# Altium project Gate_Driver.PrjPcb
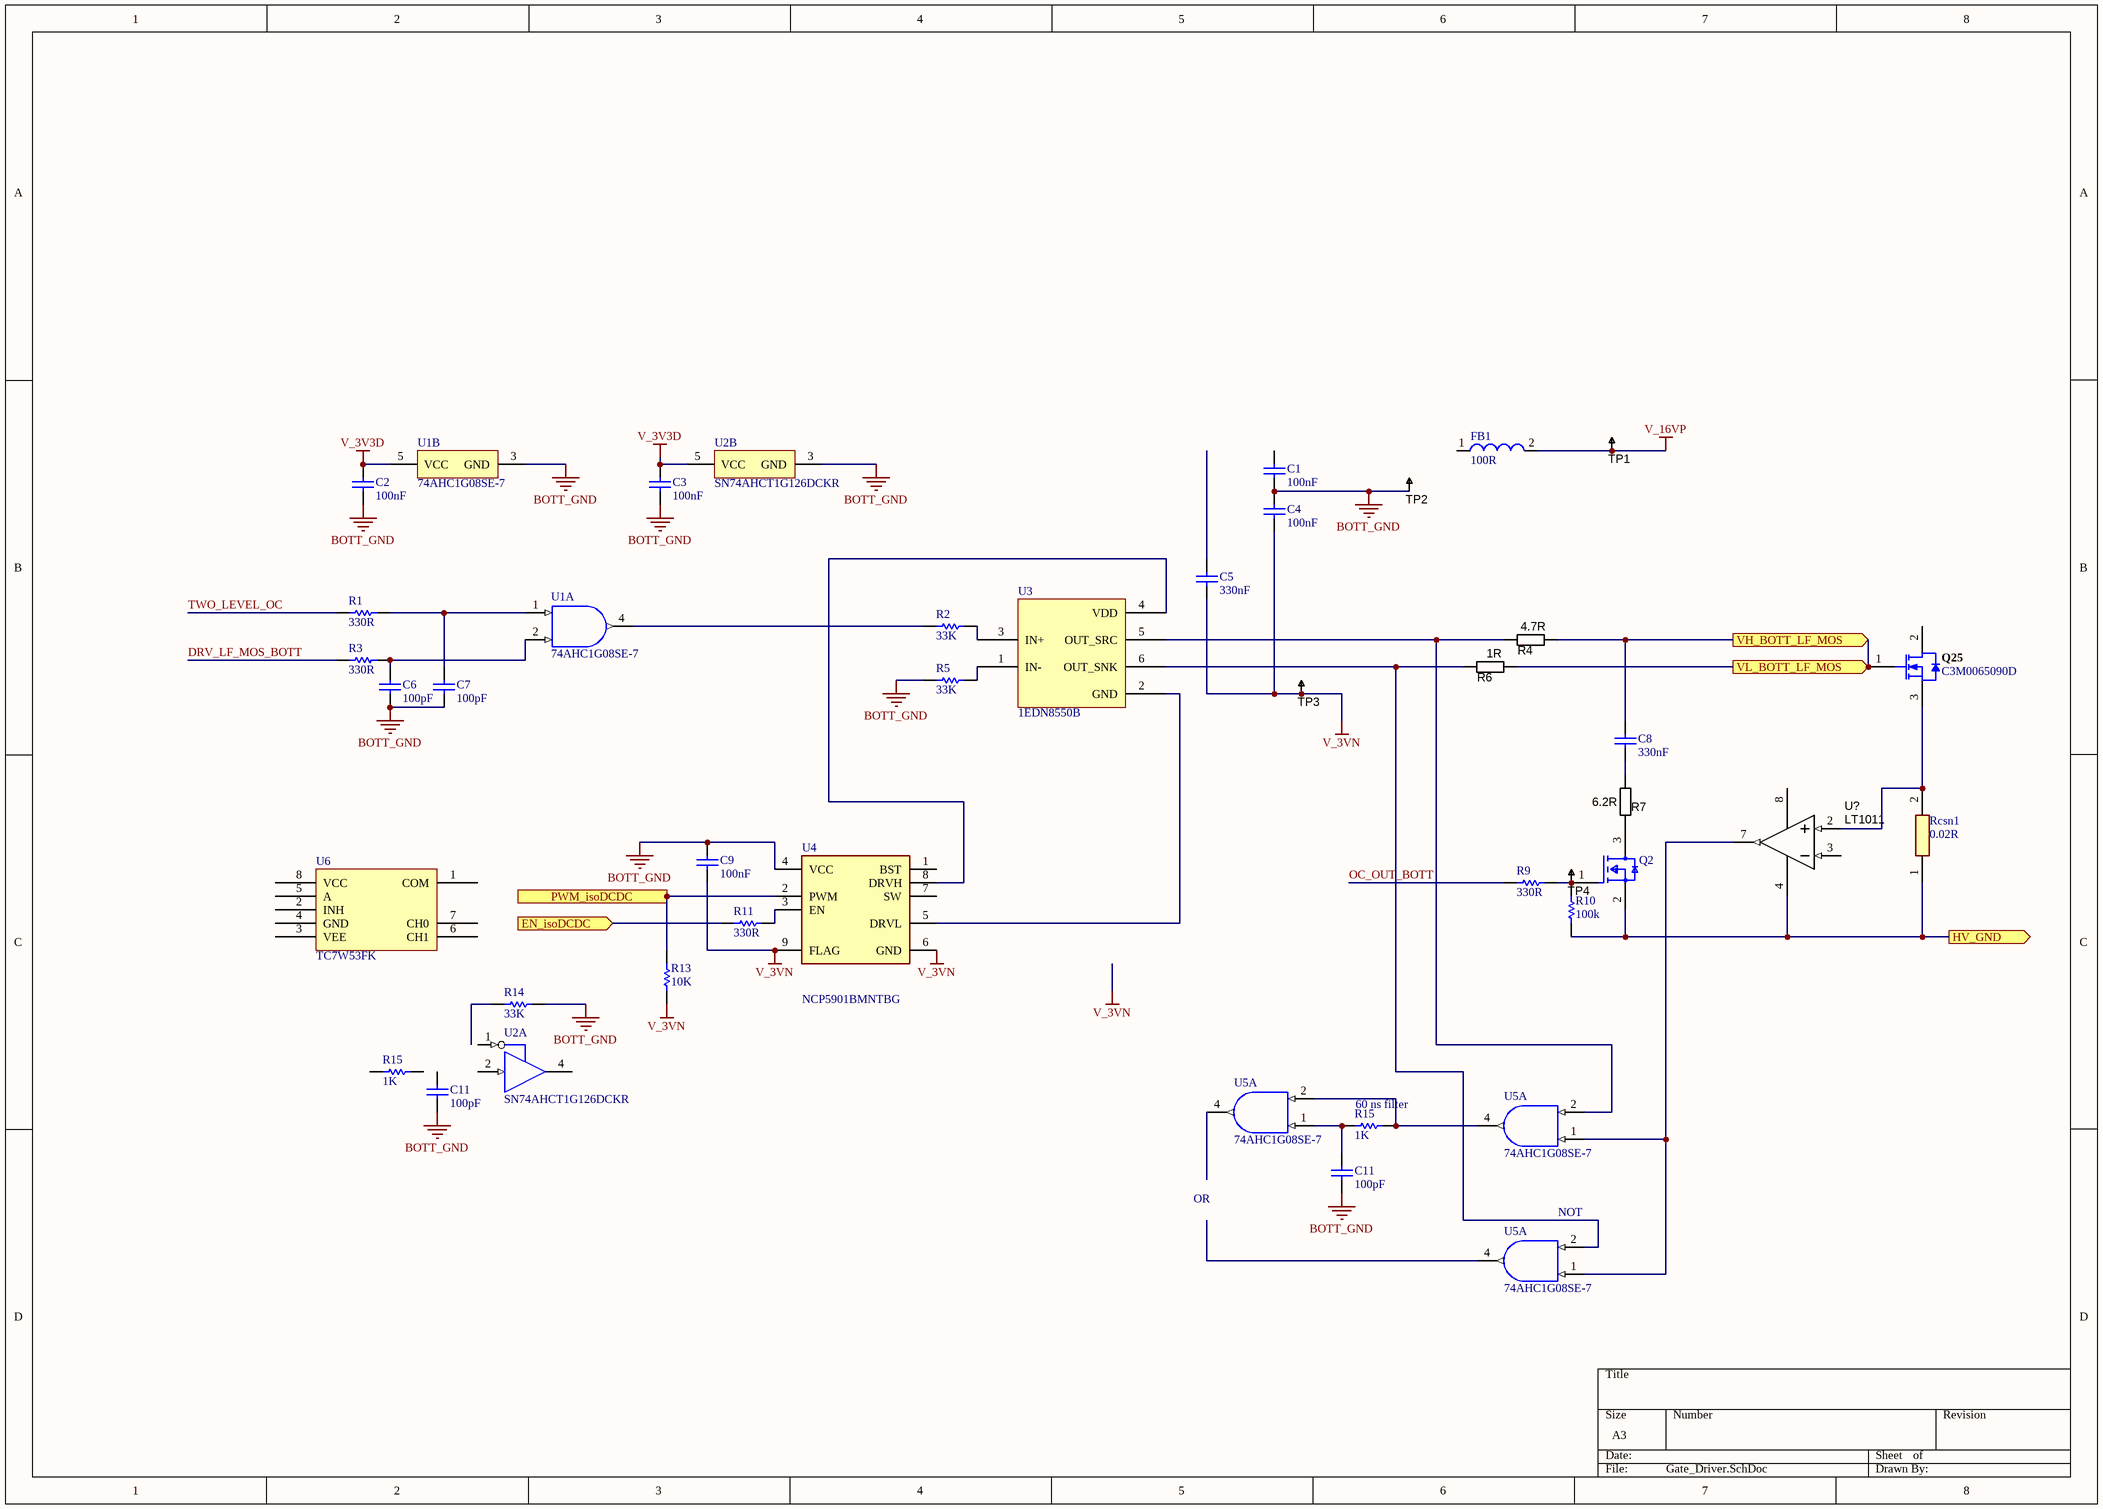
[diagram p0: Gate_Driver.SchDoc]
1 sheet, 42 parts. Net scope: flat (ports and power ports of the same name join across sheets).
Board file: Gate_Driver.PcbDoc

## Sheet Gate_Driver.SchDoc
size A3; SheetNumber: 1; SheetTotal: 1

### Parts
(Parts that share a designator on the sheet are numbered #1, #2 ... from top to bottom, then left to right.)
C1  100nF  [CAPC1608X90X35NL10T15]
C2  100nF  [CAPC1608X90X35NL10T15]
C3  100nF  [CAPC1608X90X35NL10T15]
C4  100nF  [CAPC1608X90X35NL10T15]
C5  330nF  [CAPC2013X135X45LL10T25]
C6  100pF  [CAPC1608X90X35NL10T15]
C7  100pF  [CAPC1608X90X35NL10T15]
C8  330nF  [CAPC2013X135X45LL10T25]
C9  100nF  [CAPC1608X90X35NL10T15]
C11#1  100pF  [CAPC1005X55X25NL05T10]
C11#2  100pF  [CAPC1005X55X25NL05T10]
FB1  100R  [SMD-0603]
Q2  DMN3067LW-7  [SOT323]  (value not drawn)
Q25  C3M0065090D  [TO-247]
R1  330R  [RESC1608X55X25NL10T15]
R2  33K  [RESC1005X40X25ML05T05]
R3  330R  [RESC1608X55X25NL10T15]
R4  4.7R  [RESC2012X70N]
R5  33K  [RESC1005X40X25ML05T05]
R6  1R  [RESC2012X70N]
R7  6.2R  [RESC2012X70N]
R9  330R  [RESC1608X55X25NL10T15]
R10  100k  [RESC1608X55X30NL15T15]
R11  330R  [RESC1608X55X25NL10T15]
R13  10K  [RESC1608X55X25NL10T15]
R14  33K  [RESC1005X40X25ML05T05]
R15#1  1K  [RESC1005X40X25NL05T10]
R15#2  1K  [RESC1005X40X25NL05T10]
Rcsn1  0.02R  [RESC1632X80N]
TP1  TESTPOINT  [TP-R60]  (value not drawn)  (no BOM)
TP2  TESTPOINT  [TP-R60]  (value not drawn)  (no BOM)
TP3  TESTPOINT  [TP-R60]  (value not drawn)  (no BOM)
TP4  TESTPOINT  [TP-R60]  (value not drawn)  (no BOM)
U1  74AHC1G08SE-7  [DCK0005A_M]  (parts A,B of 2)
U2  SN74AHCT1G126DCKR  [DCK0005A_M]  (parts A,B of 2)
U3  1EDN8550B  [SOT23-6]
U4  NCP5901BMNTBG  [SON50P200X200X100-9N]
U5#1  74AHC1G08SE-7  [DCK0005A_M]  (part A of 2)
U5#2  74AHC1G08SE-7  [DCK0005A_M]  (part A of 2)
U5#3  74AHC1G08SE-7  [DCK0005A_M]  (part A of 2)
U6  TC7W53FK  [SSOP8-P-0.50A]
U?  LT1011  [SOIC127P600X175-8AN]

### Ports
EN_isoDCDC (in), HV_GND (out), PWM_isoDCDC (in), VH_BOTT_LF_MOS (out), VL_BOTT_LF_MOS (out)

### Nets
BOTT_GND: C1.1 C2.1 C3.1 C4.2 C6.1 C7.1 C9.2 C11#1.1 C11#2.1 R5.1 R14.2 TP2.1 U1.3(GND) U2.3(GND) U4.4(VCC)
V_3V3D: C2.2 C3.2 U1.5(VCC) U2.5(VCC)
V_3VN: C4.1 C5.1 C9.1 R13.1 TP3.1 U4.6(GND) U4.9(FLAG)
V_16VP: FB1.2 TP1.1
DRV_LF_MOS_BOTT: R3.1
OC_OUT_BOTT: R9.1
TWO_LEVEL_OC: R1.1
NetC6_2: C6.2 R3.2 U1.2(B)
NetC7_2: C7.2 R1.2 U1.1(A)
NetC8_1: C8.1 R7.2
NetC8_2: C8.2 Q25.1(G) R4.2 R6.2 ; port VH_BOTT_LF_MOS, port VL_BOTT_LF_MOS
NetC11#2_2: C11#2.2 R15#2.1 U5#1.1(A)
NetQ2_1: Q2.1(G) R9.2 R10.2 TP4.1
NetQ2_2: Q2.2(S) R10.1 Rcsn1.1 U?.4(V-) ; port HV_GND
NetQ2_3: Q2.3(D) R7.1
NetQ25_3: Q25.3(S) Rcsn1.2 U?.2(IN+)
NetR2_1: R2.1 U1.4(Y)
NetR2_2: R2.2 U3.3(IN+)
NetR4_1: R4.1 U3.5(OUT_SRC) U5#2.2(B)
NetR5_2: R5.2 U3.1(IN-)
NetR6_1: R6.1 U3.6(OUT_SNK) U5#3.2(B)
NetR11_1: R11.1 U4.3(EN)
NetR11_2: R11.2 ; port EN_isoDCDC
NetR13_2: R13.2 U4.2(PWM) ; port PWM_isoDCDC
NetR15#2_2: R15#2.2 U5#1.2(B) U5#2.4(Y)
NetU3_2: U3.2(GND) U4.5(DRVL)
NetU3_4: U3.4(VDD) U4.8(DRVH)
NetU5#2_1: U5#2.1(A) U5#3.1(A) U?.7(OUT)

Not connected (* = marked no-connect by the designer): C1 2; C5 2; C11#1 2; FB1 1; Q25 2(D); R14 1; R15#1 1 2; U2 1(OE) 2(A) 4(Y); U4 1(BST) 7(SW); U5#1 4(Y); U5#3 4(Y); U6 1(COM) 2(INH) 3(VEE) 4(GND) 5(A) 6(CH1) 7(CH0) 8(VCC); U? 3(IN-) 8(V+)

### Notes on the sheet
- (near R15#2) 60 ns filter
- OR
- (near U5#3) NOT

### Library data of the parts
C1-C4 C9 = CAP: X7R 100nF ±10% 50V 0603 Multilayer Ceramic Capacitors MLCC - SMD/SMT ROHS; Part Number: GCM188R72A104KA64D; Manufacturer: Murata; Manufacturer Part Number: CC0603KRX7R9BB104; Voltage Rating: 100V; Supplier 1: Arrow Electronics; Supplier Part Number 1: GCM188R72A104KA64D; RoHS: Yes; Category: Ceramic Capacitors; Mount: Surface Mount; Case/Package: 0603; Case Code (Imperial): 0603; Case Code (Metric): 1608; Min Operating Temperature: -55°C; Max Operating Temperature: 125°C; Tolerance: 10%; Packaging: Tape and Reel; Capacitance: 100nF; Dielectric: X7R; Termination: SMD/SMT; Voltage Rating (DC): 100V; Length: 1.6mm; Height: 0.8mm; Depth: 0.8mm; Radiation Hardening: No; ComponentLink1URL: https://datasheet.ciiva.com/17451/product-17451047.pdf?src-supplier=Avnet+Europe; ComponentLink1Description: https://datasheet.ciiva.com/17451/product-17451047.pdf?src-supplier=Avnet+Europe; ComponentLink2URL: https://datasheet.ciiva.com/26889/getdatasheetpartid-387765-26889164.pdf?src-supplier=Verical; ComponentLink2Description: https://datasheet.ciiva.com/26889/getdatasheetpartid-387765-26889164.pdf?src-supplier=Verical; Parameter 1: *; JLCPCB Part #: C14663
C5 C8 = CAP-NP-2: X7R ±10% 50V 330nF 0805 Multilayer Ceramic Capacitors MLCC - SMD/SMT ROHS; Manufacturer: Murata; Manufacturer Part Number: GRM21BR71H104KA01L; Capacitance: 100nF; Insulation Resistance: 10GR; Package Description: 2-Pin Surface Mount Device, Body 2 x 1.25 mm; Manufacturer URL: http://www.murata.com/; Case Code (Imperial): 0805; Voltage: 50V; Datasheet URL: http://psearch.en.murata.com/capacitor/product/GRM21BR71H104KA01%23.pdf; Termination: SMD/SMT; Lead Free: LeadFree; Package Quantity: 1; Mount: SurfaceMount; REACH SVHC: Unknown; Thickness: 0.053inch; Height: 1.25mm; Case/Package: 0805; Voltage Rating: 50V; Dielectric Material: Ceramic; Width: 0.049inch; Case Code (Metric): 2012; Material: Ceramic; Min Operating Temperature: -55degC; RoHSCompliant: true; Datasheet Version: 42675.0; Voltage Rating (DC): 50V; Tolerance: 10%; Dielectric: X7R; Package Reference: 0805; Depth: 1.25mm; Length: 2mm; Max Operating Temperature: 125degC; Packaging: TapeandReel; Number of Pins: 2; Radiation Hardening: No; Supplier 1: Farnell; Supplier Part Number 1: 2408531; RoHS: Yes; Category: Ceramic Capacitors; Stock 1: 576000; ComponentLink1URL: https://datasheet.ciiva.com/11786/0900766b8003061f-11786305.pdf?src-supplier=RSComponents; ComponentLink1Description: https://datasheet.ciiva.com/11786/0900766b8003061f-11786305.pdf?src-supplier=RSComponents; ComponentLink2URL: https://datasheet.ciiva.com/20173/71-2024-20173169.pdf?src-supplier=Rapid+Electronics; ComponentLink2Description: https://datasheet.ciiva.com/20173/71-2024-20173169.pdf?src-supplier=Rapid+Electronics; ComponentLink3URL: https://datasheet.ciiva.com/29200/453120-da-01-en-vs-kondensator-0805-29200537.pdf?src-supplier=Conrad; ComponentLink3Description: https://datasheet.ciiva.com/29200/453120-da-01-en-vs-kondensator-0805-29200537.pdf?src-supplier=Conrad; ComponentLink4URL: https://datasheet.ciiva.com/132/partnumbering-e-01-132209.pdf?src-supplier=Digi-Key; ComponentLink4Description: https://datasheet.ciiva.com/132/partnumbering-e-01-132209.pdf?src-supplier=Digi-Key; ComponentLink5URL: https://datasheet.ciiva.com/132/partnumbering-e-01-132210.pdf?src-supplier=Digi-Key; ComponentLink5Description: https://datasheet.ciiva.com/132/partnumbering-e-01-132210.pdf?src-supplier=Digi-Key; ComponentLink6URL: https://datasheet.ciiva.com/132/partnumbering-e-01-132211.pdf?src-supplier=Digi-Key; ComponentLink6Description: https://datasheet.ciiva.com/132/partnumbering-e-01-132211.pdf?src-supplier=Digi-Key; ComponentLink7URL: https://datasheet.ciiva.com/7937/1794405-7937708.pdf?src-supplier=Element14; ComponentLink7Description: https://datasheet.ciiva.com/7937/1794405-7937708.pdf?src-supplier=Element14; ComponentLink8URL: https://datasheet.ciiva.com/7937/1794405-7937709.pdf?src-supplier=Element14; ComponentLink8Description: https://datasheet.ciiva.com/7937/1794405-7937709.pdf?src-supplier=Element14; ComponentLink9URL: https://datasheet.ciiva.com/28534/1769893-28534317.pdf?src-supplier=Element14; ComponentLink9Description: https://datasheet.ciiva.com/28534/1769893-28534317.pdf?src-supplier=Element14; ComponentLink10URL: https://datasheet.ciiva.com/7937/4360-7937710.pdf?src-supplier=Element14; ComponentLink10Description: https://datasheet.ciiva.com/7937/4360-7937710.pdf?src-supplier=Element14; JLCPCB Part #: C1740
C6 C7 = CMP-2006-02595-1: C0G ±5% 50V 100pF 0603 Multilayer Ceramic Capacitors MLCC - SMD/SMT ROHS; Part Number: GRM1885C1H101JA01D; Manufacturer: Murata; Temperature Coefficient: 30ppm/°C; Insulation Resistance: 10GR; Supplier 1: Digi-Key; Supplier Part Number 1: 490-1427-1-ND; Manufacturer Part Number: GRM1885C1H101JA01D; RoHS: Yes; Category: Ceramic Capacitors; Stock 1: 98306; Pricing 1: 1=0.10000, 10=0.06100, 50=0.03320, 100=0.02700, 500=0.01932, 1000=0.01518 (USD); Mount: Surface Mount; Case/Package: 0603; Number of Pins: 2; Case Code (Metric): 1608; Case Code (Imperial): 0603; Dielectric Material: Ceramic; Weight: 7.1E-05oz; Material: Ceramic; Min Operating Temperature: -55°C; Max Operating Temperature: 125°C; Capacitance: 100pF; Voltage Rating: 50V; Tolerance: 5%; Packaging: Tape and Reel; Package Quantity: 1; Voltage Rating (DC): 50V; Dielectric: C0G; Termination: SMD/SMT; Voltage: 50V; Length: 1.6mm; Width: 0.031inch; Height: 0.8mm; Thickness: 0.035inch; Depth: 0.8mm; Radiation Hardening: No; RoHS Compliant: Yes; REACH SVHC: Unknown; Lead Free: Lead Free; ComponentLink1URL: https://datasheet.ciiva.com/131/product-131088.pdf?src-supplier=Digi-Key; ComponentLink1Description: https://datasheet.ciiva.com/131/product-131088.pdf?src-supplier=Digi-Key; ComponentLink2URL: https://datasheet.ciiva.com/18100/getdatasheetpartid-26823-18100641.pdf?src-supplier=Verical; ComponentLink2Description: https://datasheet.ciiva.com/18100/getdatasheetpartid-26823-18100641.pdf?src-supplier=Verical; ComponentLink3URL: https://datasheet.ciiva.com/3777/grm1885c1h101ja0123-3777264.pdf?src-supplier=Arrow+Electronics; ComponentLink3Description: https://datasheet.ciiva.com/3777/grm1885c1h101ja0123-3777264.pdf?src-supplier=Arrow+Electronics; ComponentLink4URL: https://datasheet.ciiva.com/29149/450134-da-01-en-vs-kondensator-0603-29149008.pdf?src-supplier=Conrad; ComponentLink4Description: https://datasheet.ciiva.com/29149/450134-da-01-en-vs-kondensator-0603-29149008.pdf?src-supplier=Conrad; ComponentLink5URL: https://datasheet.ciiva.com/131/partnumbering-e-01-131089.pdf?src-supplier=Digi-Key; ComponentLink5Description: https://datasheet.ciiva.com/131/partnumbering-e-01-131089.pdf?src-supplier=Digi-Key; ComponentLink6URL: https://datasheet.ciiva.com/11605/c02e-11605557.pdf?src-supplier=Avnet; ComponentLink6Description: https://datasheet.ciiva.com/11605/c02e-11605557.pdf?src-supplier=Avnet; ComponentLink7URL: https://datasheet.ciiva.com/28556/4360-28556551.pdf?src-supplier=Element14; ComponentLink7Description: https://datasheet.ciiva.com/28556/4360-28556551.pdf?src-supplier=Element14; ComponentLink8URL: https://datasheet.ciiva.com/7828/4360-7828889.pdf?src-supplier=Element14; ComponentLink8Description: https://datasheet.ciiva.com/7828/4360-7828889.pdf?src-supplier=Element14; ComponentLink9URL: https://datasheet.ciiva.com/7828/4360-7828890.pdf?src-supplier=Element14; ComponentLink9Description: https://datasheet.ciiva.com/7828/4360-7828890.pdf?src-supplier=Element14; ComponentLink10URL: https://datasheet.ciiva.com/7828/4360-7828891.pdf?src-supplier=Element14; ComponentLink10Description: https://datasheet.ciiva.com/7828/4360-7828891.pdf?src-supplier=Element14; ComponentLink11URL: https://datasheet.ciiva.com/14116/grmseries-tc-hitype-eng-14116828.pdf?src-supplier=Distrelec; ComponentLink11Description: https://datasheet.ciiva.com/14116/grmseries-tc-hitype-eng-14116828.pdf?src-supplier=Distrelec; ComponentLink12URL: https://datasheet.ciiva.com/16291/product-16291613.pdf?src-supplier=Future+Electronics; ComponentLink12Description: https://datasheet.ciiva.com/16291/product-16291613.pdf?src-supplier=Future+Electronics; ComponentLink13URL: https://datasheet.ciiva.com/131/partnumbering-e-01-131087.pdf?src-supplier=Digi-Key; ComponentLink13Description: https://datasheet.ciiva.com/131/partnumbering-e-01-131087.pdf?src-supplier=Digi-Key; ComponentLink14URL: https://datasheet.ciiva.com/14116/grmseries-tc-hitype-eng-14116815.pdf?src-supplier=Distrelec; ComponentLink14Description: https://datasheet.ciiva.com/14116/grmseries-tc-hitype-eng-14116815.pdf?src-supplier=Distrelec; JLCPCB Part #: C14858
C11#1 C11#2 = CMP-2008-04245-1: C0G ±5% 50V 100pF 0402 Multilayer Ceramic Capacitors MLCC - SMD/SMT ROHS; Part Number: GRM1555C1H100JA01D; Manufacturer: Murata; Capacitance: 10pF; Temperature Coefficient: 30ppm/°C; Supplier 1: Digi-Key; Supplier Part Number 1: 490-5921-1-ND; Manufacturer Part Number: GRM1555C1H100JA01D; RoHS: Yes; Category: Ceramic Capacitors; Stock 1: 1896512; Pricing 1: 1=0.10000, 10=0.01900, 50=0.01060, 100=0.00860, 500=0.00616, 1000=0.00484, 2500=0.00440, 5000=0.00405 (USD); Mount: Surface Mount; Case/Package: 0402; Number of Pins: 2; Case Code (Metric): 1005; Case Code (Imperial): 0402; Material: Ceramic; Min Operating Temperature: -55°C; Max Operating Temperature: 125°C; Tolerance: 5%; Dielectric: C0G; Voltage Rating: 50V; Packaging: Tape and Reel; Package Quantity: 10000; Voltage Rating (DC): 50V; Termination: SMD/SMT; Series: GRM; Construction: Flat; Voltage: 50V; Length: 1mm; Width: 0.02inch; Height: 0.5mm; Thickness: 0.022inch; Depth: 0.5mm; Radiation Hardening: No; RoHS Compliant: Yes; REACH SVHC: No SVHC; Lead Free: Lead Free; ComponentLink1URL: https://datasheet.ciiva.com/2989/product-2989280.pdf?src-supplier=Avnet; ComponentLink1Description: https://datasheet.ciiva.com/2989/product-2989280.pdf?src-supplier=Avnet; ComponentLink2URL: https://datasheet.ciiva.com/18184/getdatasheetpartid-307234-18184164.pdf?src-supplier=Verical; ComponentLink2Description: https://datasheet.ciiva.com/18184/getdatasheetpartid-307234-18184164.pdf?src-supplier=Verical; ComponentLink3URL: https://datasheet.ciiva.com/29200/453545-da-01-en-vs-kondensator-0402-29200107.pdf?src-supplier=Conrad; ComponentLink3Description: https://datasheet.ciiva.com/29200/453545-da-01-en-vs-kondensator-0402-29200107.pdf?src-supplier=Conrad; ComponentLink4URL: https://datasheet.ciiva.com/6271/partnumbering-e-01-6271158.pdf?src-supplier=Digi-Key; ComponentLink4Description: https://datasheet.ciiva.com/6271/partnumbering-e-01-6271158.pdf?src-supplier=Digi-Key; ComponentLink5URL: https://datasheet.ciiva.com/48671/product-48671350.pdf?src-supplier=Avnet; ComponentLink5Description: https://datasheet.ciiva.com/48671/product-48671350.pdf?src-supplier=Avnet; ComponentLink6URL: https://datasheet.ciiva.com/6271/partnumbering-e-01-6271159.pdf?src-supplier=Digi-Key; ComponentLink6Description: https://datasheet.ciiva.com/6271/partnumbering-e-01-6271159.pdf?src-supplier=Digi-Key; ComponentLink7URL: https://datasheet.ciiva.com/6271/partnumbering-e-01-6271068.pdf?src-supplier=Digi-Key; ComponentLink7Description: https://datasheet.ciiva.com/6271/partnumbering-e-01-6271068.pdf?src-supplier=Digi-Key; ComponentLink8URL: https://datasheet.ciiva.com/7828/1666664-7828812.pdf?src-supplier=Element14; ComponentLink8Description: https://datasheet.ciiva.com/7828/1666664-7828812.pdf?src-supplier=Element14; JLCPCB Part #: C1546
FB1 = CMP-0220-00115-1: SMD EMI Suppression Ferrite Bead WE-CBF, Z = 1500 Ohm; DatasheetVersion: Dec-2005; ComponentLink1URL: http://www.we-online.com; PackageVersion: 2009; PackageDescription: Chip Inductor, 2-Leads, Body 1.6 x 0.8 mm; ComponentLink2URL: http://www.we-online.de/katalog/media/pdf/742792691.pdf; ComponentLink1Description: Manufacturer Link; ComponentLink2Description: Datasheet; Impedance: 1500 Ohm; PackageReference: SMD-0603
Q2 = 381a366367e4312d0f7d2747150cb42: MOSFET N-CH 60V 115MA SOT323; Element Configuration: Single; Nominal Vgs: 2V; Drain to Source Breakdown Voltage: 70V; Drain to Source Resistance: 2.6R; Input Capacitance: 50pF; On-State Resistance: 7.5R; Number of Channels: 1; Power Dissipation: 200mW; Turn-Off Delay Time: 11ns; Turn-On Delay Time: 7ns; Gate to Source Voltage (Vgs): 20V; Dual Supply Voltage: 60V; Contact Plating: Tin; Min Operating Temperature: -55°C; Radiation Hardening: No; Drain to Source Voltage (Vdss): 60V; Height: 1mm; Max Operating Temperature: 150°C; Voltage Rating (DC): 60V; Case/Package: SOT-323; Weight: 0.000212oz; Mount: Surface Mount; Length: 2.2mm; Lead Free: Lead Free; Threshold Voltage: 2V; Packaging: Tape and Reel; Max Power Dissipation: 200mW; Package Quantity: 1; Continuous Drain Current (ID): 115mA; Number of Pins: 3; Width: 1.35mm; Current Rating: 115mA; Rds On Max: 7.5R; REACH SVHC: No SVHC; Termination: SMD/SMT; Number of Elements: 1
Q25 = NEMOS-GDS-3: Silicon Carbide Power MOSFET C2M(TM) MOSFET Technology, 1200 V, 90 A, -55 to 150 degC, 3-Pin TO-247, RoHS, Tube; Manufacturer: Cree,Inc.; Qg - Gate Charge: 406nC; Trr: 32ns; Fall Time: 28.4ns; Rise Time: 31.6ns; Vds - Drain-Source Breakdown Voltage: 1200V; Id: 90A; Vgs th - Gate-Source Threshold Voltage: 2.4V; Unit Weight: 1.340411oz; Typical Turn-On Delay Time: 14.4ns; Pd - Power Dissipation: 463W; Configuration: Single; Typical Turn-Off Delay Time: 28.8ns; Vgss: 20V; Transistor Polarity: N-Channel; Rds On - Drain-Source Resistance: 25mOhms; Vth: 2.6V; Forward Transconductance - Min: 23.6S; Number of Channels: 1Channel; Transistor Type: 1N-Channel; RDS(on): 0.025Ohm; Channel Mode: Enhancement; Vgs - Gate-Source Voltage: -10V,+25V; Product: PowerMOSFET; Datasheet URL: http://www.wolfspeed.com/media/downloads/161/C2M0025120D.pdf; Packaging: Tube; Package Reference: TO-247-3; Manufacturer URL: http://www.cree.com/; Product Category: MOSFET; Factory Pack Quantity: 30; Height: 21.1mm; Minimum Operating Temperature: -55C; Datasheet Version: Rev. B, 10/2015; Type: SiliconCarbidePowerMOSFET; Technology: SiC; Length: 5.21mm; Width: 16.13mm; Vdss: 1200V; Brand: Cree,Inc.; Mounting Technology: ThroughHole; Package / Case: TO-247-3; RoHS: True; Package Description: 3-Pin Flange Mount, Vertical Straight Lead, Body 15.94 x 5.02 mm, Pitch 5.44 mm; Maximum Operating Temperature: +150C; Mounting Style: ThroughHole; Id - Continuous Drain Current: 90A
R1 R3 R9 = CMP-1659-00020-2: ±1% 330Ω ±100ppm/℃ 0.1W 0603 Chip Resistor - Surface Mount ROHS; Tolerance: 10%; ESR: 800 mohm; Voltage Rating (DC): 16 V; Capacitance: 47 uF; Length: 7.3 mm; ComponentLink1URL: http://www.yageo.com/; Packaging: Tape and Reel; Pins: 2; ComponentLink1Description: Manufacturer URL; Case Code (Imperial): 2917; REACH SVHC: No SVHC; Width: 4.3 mm; ComponentLink2Description: Datasheet; Voltage Rating: 16 V; RoHSCompliant: True; Max Operating Temperature: 125degC; ComponentLink2URL: http://www.yageo.com/documents/recent/PYu-RC_Group_51_RoHS_L_04.pdf; Min Operating Temperature: -55degC; Case/Package: 2917; Radiation Hardening: No; DatasheetVersion: Rev. 4, 02/2016; Mount: Surface Mount; PackageReference: 0603; Package Quantity: 500; Case Code (Metric): 7343; PackageDescription: 2-Pin Surface Mount Device, Body 1.6 x 0.8 mm; Height: 3.1 mm; Parameter 1: *; JLCPCB Part #: C23138
R2 R5 = CMP-2002-01144-1: S, THICK FILM, 33K, 100mW, 1%, 0402, FULL REEL; Product Range:PANASONIC - ERJ Series; Resistance:33kohm; Power Rating:100mW; Resistance Tolerance:± 1%; Resistor Case Style:0402 ^1005 Metric]; Resistor Element Type:Thick Film; Part Number: ERJ2RKF3302X; Manufacturer Part Number: ERJ-2RKF3302X; Resistance: 33kR; Voltage Rating: 50V; Temperature Coefficient: 100ppm/°C; Manufacturer: Panasonic; Supplier 1: Digi-Key; Supplier Part Number 1: P33.0KLCT-ND; RoHS: Yes; Category: Chip SMD Resistors; Stock 1: 8872; Pricing 1: 1=0.10000, 10=0.02500, 100=0.01020, 1000=0.00457, 2500=0.00397, 5000=0.00328 (USD); Mount: Surface Mount; Case/Package: 0402; Number of Pins: 2; Case Code (Metric): 1005; Case Code (Imperial): 0402; Contact Plating: Tin; Min Operating Temperature: -55°C; Max Operating Temperature: 155°C; Packaging: Tape and Reel; Tolerance: 1%; Power Rating: 100mW; Termination: SMD/SMT; Resistor Type: Thick Film; Max Power Dissipation: 100mW; Number of Terminations: 2; Package Quantity: 1; Voltage Rating (DC): 50V; Features: Automotive AEC-Q200; Length: 1mm; Width: 0.02inch; Height: 0.35mm; Depth: 0.5mm; Radiation Hardening: No; Military Standard: Not; Lead Free: Lead Free; REACH SVHC: No SVHC; ComponentLink1URL: https://datasheet.ciiva.com/11821/0900766b80f80784-11821294.pdf?src-supplier=RSComponents; ComponentLink1Description: https://datasheet.ciiva.com/11821/0900766b80f80784-11821294.pdf?src-supplier=RSComponents; ComponentLink2URL: https://datasheet.ciiva.com/16784/70260748-16784773.pdf?src-supplier=Allied+Electronics; ComponentLink2Description: https://datasheet.ciiva.com/16784/70260748-16784773.pdf?src-supplier=Allied+Electronics; ComponentLink3URL: https://datasheet.ciiva.com/22673/1678782-22673685.pdf?src-supplier=Element14; ComponentLink3Description: https://datasheet.ciiva.com/22673/1678782-22673685.pdf?src-supplier=Element14; ComponentLink4URL: https://datasheet.ciiva.com/22737/426256-22737285.pdf?src-supplier=Element14; ComponentLink4Description: https://datasheet.ciiva.com/22737/426256-22737285.pdf?src-supplier=Element14; ComponentLink5URL: https://datasheet.ciiva.com/30159/aoa0000ce2-30159014.pdf?src-supplier=Onlinecomponents.com; ComponentLink5Description: https://datasheet.ciiva.com/30159/aoa0000ce2-30159014.pdf?src-supplier=Onlinecomponents.com; ComponentLink6URL: https://datasheet.ciiva.com/9190/aoa0000ce2-9190679.pdf?src-supplier=Avnet; ComponentLink6Description: https://datasheet.ciiva.com/9190/aoa0000ce2-9190679.pdf?src-supplier=Avnet; ComponentLink7URL: https://datasheet.ciiva.com/17210/aoa0000ce2-17210312.pdf?src-supplier=Avnet+Europe; ComponentLink7Description: https://datasheet.ciiva.com/17210/aoa0000ce2-17210312.pdf?src-supplier=Avnet+Europe; ComponentLink8URL: https://datasheet.ciiva.com/7802/aoa0000ce2-7802409.pdf?src-supplier=Element14; ComponentLink8Description: https://datasheet.ciiva.com/7802/aoa0000ce2-7802409.pdf?src-supplier=Element14; ComponentLink9URL: https://datasheet.ciiva.com/46420/1678782-46420317.pdf?src-supplier=Element14; ComponentLink9Description: https://datasheet.ciiva.com/46420/1678782-46420317.pdf?src-supplier=Element14; ComponentLink10URL: https://datasheet.ciiva.com/24024/aoa0000ce2-24024398.pdf?src-supplier=Mouser; ComponentLink10Description: https://datasheet.ciiva.com/24024/aoa0000ce2-24024398.pdf?src-supplier=Mouser; ComponentLink11URL: https://datasheet.ciiva.com/22687/1678782-22687071.pdf?src-supplier=Element14; ComponentLink11Description: https://datasheet.ciiva.com/22687/1678782-22687071.pdf?src-supplier=Element14
R4 = RES_EMPTY_0805: 4.7Ω ±1% ±400ppm/℃ 0.125W 0805 Chip Resistor - Surface Mount ROHS; Value: N/A; Package / Case: 0805 (2012 metric); JLCPCB Part #: C17675
R6 = RES_EMPTY_0805: ±1% 1Ω ±400ppm/℃ 0.125W 0805 Chip Resistor - Surface Mount ROHS; Value: N/A; Package / Case: 0805 (2012 metric); JLCPCB Part #: C25271
R7 = RES_EMPTY_0805: Resistor, 0805 SMD, Empty footprint; Value: N/A; Package / Case: 0805 (2012 metric)
R10 = CMP-2000-00182-1: ±1% 100kΩ ±100ppm/℃ 0.1W 0603 Chip Resistor - Surface Mount ROHS; Part Number: ERJ-3EKF1003V; Manufacturer: Panasonic; Manufacturer Part Number: ERJ3EKF1003V; Resistance: 100kR; Power Rating: 100mW; Temperature Coefficient: 100ppm/°C; Voltage Rating: 75V; Supplier 1: Digi-Key; Supplier Part Number 1: P100KHCT-ND; RoHS: Yes; Category: Chip SMD Resistors; Stock 1: 2532776; Pricing 1: 1=0.10000, 10=0.05700, 100=0.02340, 1000=0.01049, 2500=0.00911 (USD); Mount: Surface Mount; Case/Package: 0603; Number of Pins: 2; Weight: 7.1E-05oz; Case Code (Imperial): 0603; Case Code (Metric): 1608; Contact Plating: Tin; Min Operating Temperature: -55°C; Max Operating Temperature: 155°C; Tolerance: 1%; Packaging: Tape and Reel; Composition: Thick Film; Termination: SMD/SMT; Package Quantity: 5000; Number of Terminations: 2; Max Power Dissipation: 100mW; Military Standard: Not; Voltage Rating (DC): 75V; Features: Automotive AEC-Q200; Length: 1.6mm; Height: 0.022inch; Width: 0.8mm; Depth: 0.8mm; Radiation Hardening: No; Lead Free: Lead Free; REACH SVHC: No SVHC; ComponentLink1URL: https://datasheet.ciiva.com/34303/1987476-34303566.pdf?src-supplier=Jameco; ComponentLink1Description: https://datasheet.ciiva.com/34303/1987476-34303566.pdf?src-supplier=Jameco; ComponentLink2URL: https://datasheet.ciiva.com/30133/aoa0000ce2-30133845.pdf?src-supplier=Onlinecomponents.com; ComponentLink2Description: https://datasheet.ciiva.com/30133/aoa0000ce2-30133845.pdf?src-supplier=Onlinecomponents.com; ComponentLink3URL: https://datasheet.ciiva.com/15158/getdatasheetpartid-247527-15158907.pdf?src-supplier=Verical; ComponentLink3Description: https://datasheet.ciiva.com/15158/getdatasheetpartid-247527-15158907.pdf?src-supplier=Verical; ComponentLink4URL: https://datasheet.ciiva.com/16770/70260748-16770253.pdf?src-supplier=Allied+Electronics; ComponentLink4Description: https://datasheet.ciiva.com/16770/70260748-16770253.pdf?src-supplier=Allied+Electronics; ComponentLink5URL: https://datasheet.ciiva.com/16740/aoa0000ce2-16740662.pdf?src-supplier=Future+Electronics; ComponentLink5Description: https://datasheet.ciiva.com/16740/aoa0000ce2-16740662.pdf?src-supplier=Future+Electronics; Supplier 2: Newark; Supplier Part Number 2: 85Y8503; Stock 2: 3015148; Pricing 2: 5000=0.02500, 10000=0.02400, 20000=0.01800 (USD); Size Code: 0603; Resistor Type: Thick Film; Series: ERJ; Resistance Tolerance: 1%; Construction: Rectangular; RoHS Compliant: Yes; JLCPCB Part #: C25803
R11 = RES-2: ±1% 330Ω ±100ppm/℃ 0.1W 0603 Chip Resistor - Surface Mount ROHS; Manufacturer: Yageo; Manufacturer Part Number: RC0603FR-07330RL; Tolerance: 10%; ESR: 800 mohm; Voltage Rating (DC): 16 V; Capacitance: 47 uF; Temperature Coefficient: 100ppm/°C; Power Rating: 100mW; Length: 7.3 mm; ComponentLink1URL: http://www.yageo.com/; Packaging: Tape and Reel; Pins: 2; ComponentLink1Description: Manufacturer URL; Case Code (Imperial): 2917; REACH SVHC: No SVHC; Width: 4.3 mm; ComponentLink2Description: Datasheet; Voltage Rating: 16 V; RoHSCompliant: True; Max Operating Temperature: 125degC; ComponentLink2URL: http://www.yageo.com/documents/recent/PYu-RC_Group_51_RoHS_L_04.pdf; Min Operating Temperature: -55degC; Case/Package: 2917; Radiation Hardening: No; DatasheetVersion: Rev. 4, 02/2016; Mount: Surface Mount; PackageReference: 0603; Package Quantity: 500; Case Code (Metric): 7343; PackageDescription: 2-Pin Surface Mount Device, Body 1.6 x 0.8 mm; Height: 3.1 mm; Supplier 1: Digi-Key; Supplier Part Number 1: 311-330HRCT-ND; RoHS: Yes; Category: Chip SMD Resistors; Stock 1: 4209654; Pricing 1: 1=0.10000, 10=0.02300, 100=0.00940, 1000=0.00421, 2500=0.00366 (USD); Number of Pins: 2; Composition: Thick Film; Resistance: 330R; Number of Terminations: 2; Max Power Dissipation: 100mW; Termination: SMD/SMT; Features: Moisture Resistant; Depth: 0.8mm; Lead Free: Lead Free; ComponentLink3URL: https://datasheet.ciiva.com/11819/0900766b80f96399-11819327.pdf?src-supplier=RSComponents; ComponentLink3Description: https://datasheet.ciiva.com/11819/0900766b80f96399-11819327.pdf?src-supplier=RSComponents; ComponentLink4URL: https://datasheet.ciiva.com/2454/pyu-r-int-thick-7-2454864.pdf?src-supplier=Digi-Key; ComponentLink4Description: https://datasheet.ciiva.com/2454/pyu-r-int-thick-7-2454864.pdf?src-supplier=Digi-Key; ComponentLink5URL: https://datasheet.ciiva.com/2454/pyu-r-int-thick-7-2454865.pdf?src-supplier=Digi-Key; ComponentLink5Description: https://datasheet.ciiva.com/2454/pyu-r-int-thick-7-2454865.pdf?src-supplier=Digi-Key; ComponentLink6URL: https://datasheet.ciiva.com/2454/pyu-r-int-thick-7-2454866.pdf?src-supplier=Digi-Key; ComponentLink6Description: https://datasheet.ciiva.com/2454/pyu-r-int-thick-7-2454866.pdf?src-supplier=Digi-Key; ComponentLink7URL: https://datasheet.ciiva.com/12555/rc0603-272842-12555334.pdf?src-supplier=Mouser; ComponentLink7Description: https://datasheet.ciiva.com/12555/rc0603-272842-12555334.pdf?src-supplier=Mouser; ComponentLink8URL: https://datasheet.ciiva.com/46440/1868787-46440904.pdf?src-supplier=Element14; ComponentLink8Description: https://datasheet.ciiva.com/46440/1868787-46440904.pdf?src-supplier=Element14; ComponentLink9URL: https://datasheet.ciiva.com/7746/443971-7746329.pdf?src-supplier=Element14; ComponentLink9Description: https://datasheet.ciiva.com/7746/443971-7746329.pdf?src-supplier=Element14; ComponentLink10URL: https://datasheet.ciiva.com/7746/443971-7746330.pdf?src-supplier=Element14; ComponentLink10Description: https://datasheet.ciiva.com/7746/443971-7746330.pdf?src-supplier=Element14; ComponentLink11URL: https://datasheet.ciiva.com/7746/1686128-7746331.pdf?src-supplier=Element14; ComponentLink11Description: https://datasheet.ciiva.com/7746/1686128-7746331.pdf?src-supplier=Element14; Parameter 1: *; JLCPCB Part #: C23138
R13 = RES-2: ±1% ±100ppm/℃ 10kΩ 0.1W 0603 Chip Resistor - Surface Mount ROHS; Manufacturer: Yageo; Manufacturer Part Number: RC0603JR-071ML; Power Rating: 100mW; Resistance Tolerance: ±5%; Product Range: RCSeries; Temperature Coefficient: ±100ppm/°C; Resistor Element Type: ThickFilm; Resistance: 1Mohm; SVHC: ToBeAdvised; Voltage Rating: 50V; Resistor Case Style: 0603[1608Metric]; Tolerance: 5%; MSL: MSL1-Unlimited; Package Description: 2-Pin Surface Mount Device, Body 1.6 x 0.8 mm; Datasheet Version: Rev. 7, 05/2017; Datasheet URL: http://www.yageo.com/documents/recent/PYu-RC_Group_51_RoHS_L_7.pdf; Manufacturer URL: http://www.yageo.com/; Package Reference: 0603; Automotive Qualification Standard: -; Packaging: CutTape; Mounting Technology: SurfaceMount; Supplier 1: Digi-Key; Supplier Part Number 1: 311-1.0MGRCT-ND; Stock 1: 3949362; Pricing 1: 1=0,10000, 10=0,01900, 100=0,00770, 1000=0,00347, 2500=0,00301 (USD); RoHS: Yes; Case/Package: 0603; Number of Pins: 2; Case Code (Imperial): 0603; Case Code (Metric): 1608; Contact Plating: Tin,Matte; Min Operating Temperature: -55°C; Max Operating Temperature: 155°C; Composition: Thick Film; Termination: SMD/SMT; Package Quantity: 5000; Military Standard: Not; Voltage Rating (DC): 50V; Length: 1.6mm; Height: 0.45mm; Width: 0.8mm; Depth: 0.8mm; Radiation Hardening: No; Lead Free: Lead Free; REACH SVHC: No SVHC; ComponentLink1URL: https://datasheet.ciiva.com/46395/443971-46395067.pdf?src-supplier=Element14; ComponentLink1Description: https://datasheet.ciiva.com/46395/443971-46395067.pdf?src-supplier=Element14; ComponentLink2URL: https://datasheet.ciiva.com/8883/pyu-rc0603-51-rohs-l-4-8883053.pdf?src-supplier=Avnet; ComponentLink2Description: https://datasheet.ciiva.com/8883/pyu-rc0603-51-rohs-l-4-8883053.pdf?src-supplier=Avnet; ComponentLink3URL: https://datasheet.ciiva.com/12555/rc0603-272842-12555342.pdf?src-supplier=Mouser; ComponentLink3Description: https://datasheet.ciiva.com/12555/rc0603-272842-12555342.pdf?src-supplier=Mouser; ComponentLink4URL: https://datasheet.ciiva.com/7746/443971-7746463.pdf?src-supplier=Element14; ComponentLink4Description: https://datasheet.ciiva.com/7746/443971-7746463.pdf?src-supplier=Element14; Parameter 1: *; JLCPCB Part #: C25804
R14 = RES: S, THICK FILM, 33K, 100mW, 1%, 0402, FULL REEL; Product Range:PANASONIC - ERJ Series; Resistance:33kohm; Power Rating:100mW; Resistance Tolerance:± 1%; Resistor Case Style:0402 ^1005 Metric]; Resistor Element Type:Thick Film; Part Number: ERJ2RKF3302X; Manufacturer Part Number: ERJ-2RKF3302X; Resistance: 33kR; Voltage Rating: 50V; Temperature Coefficient: 100ppm/°C; Manufacturer: Panasonic; Supplier 1: Digi-Key; Supplier Part Number 1: P33.0KLCT-ND; RoHS: Yes; Category: Chip SMD Resistors; Stock 1: 8872; Pricing 1: 1=0.10000, 10=0.02500, 100=0.01020, 1000=0.00457, 2500=0.00397, 5000=0.00328 (USD); Mount: Surface Mount; Case/Package: 0402; Number of Pins: 2; Case Code (Metric): 1005; Case Code (Imperial): 0402; Contact Plating: Tin; Min Operating Temperature: -55°C; Max Operating Temperature: 155°C; Packaging: Tape and Reel; Tolerance: 1%; Power Rating: 100mW; Termination: SMD/SMT; Resistor Type: Thick Film; Max Power Dissipation: 100mW; Number of Terminations: 2; Package Quantity: 1; Voltage Rating (DC): 50V; Features: Automotive AEC-Q200; Length: 1mm; Width: 0.02inch; Height: 0.35mm; Depth: 0.5mm; Radiation Hardening: No; Military Standard: Not; Lead Free: Lead Free; REACH SVHC: No SVHC; ComponentLink1URL: https://datasheet.ciiva.com/11821/0900766b80f80784-11821294.pdf?src-supplier=RSComponents; ComponentLink1Description: https://datasheet.ciiva.com/11821/0900766b80f80784-11821294.pdf?src-supplier=RSComponents; ComponentLink2URL: https://datasheet.ciiva.com/16784/70260748-16784773.pdf?src-supplier=Allied+Electronics; ComponentLink2Description: https://datasheet.ciiva.com/16784/70260748-16784773.pdf?src-supplier=Allied+Electronics; ComponentLink3URL: https://datasheet.ciiva.com/22673/1678782-22673685.pdf?src-supplier=Element14; ComponentLink3Description: https://datasheet.ciiva.com/22673/1678782-22673685.pdf?src-supplier=Element14; ComponentLink4URL: https://datasheet.ciiva.com/22737/426256-22737285.pdf?src-supplier=Element14; ComponentLink4Description: https://datasheet.ciiva.com/22737/426256-22737285.pdf?src-supplier=Element14; ComponentLink5URL: https://datasheet.ciiva.com/30159/aoa0000ce2-30159014.pdf?src-supplier=Onlinecomponents.com; ComponentLink5Description: https://datasheet.ciiva.com/30159/aoa0000ce2-30159014.pdf?src-supplier=Onlinecomponents.com; ComponentLink6URL: https://datasheet.ciiva.com/9190/aoa0000ce2-9190679.pdf?src-supplier=Avnet; ComponentLink6Description: https://datasheet.ciiva.com/9190/aoa0000ce2-9190679.pdf?src-supplier=Avnet; ComponentLink7URL: https://datasheet.ciiva.com/17210/aoa0000ce2-17210312.pdf?src-supplier=Avnet+Europe; ComponentLink7Description: https://datasheet.ciiva.com/17210/aoa0000ce2-17210312.pdf?src-supplier=Avnet+Europe; ComponentLink8URL: https://datasheet.ciiva.com/7802/aoa0000ce2-7802409.pdf?src-supplier=Element14; ComponentLink8Description: https://datasheet.ciiva.com/7802/aoa0000ce2-7802409.pdf?src-supplier=Element14; ComponentLink9URL: https://datasheet.ciiva.com/46420/1678782-46420317.pdf?src-supplier=Element14; ComponentLink9Description: https://datasheet.ciiva.com/46420/1678782-46420317.pdf?src-supplier=Element14; ComponentLink10URL: https://datasheet.ciiva.com/24024/aoa0000ce2-24024398.pdf?src-supplier=Mouser; ComponentLink10Description: https://datasheet.ciiva.com/24024/aoa0000ce2-24024398.pdf?src-supplier=Mouser; ComponentLink11URL: https://datasheet.ciiva.com/22687/1678782-22687071.pdf?src-supplier=Element14; ComponentLink11Description: https://datasheet.ciiva.com/22687/1678782-22687071.pdf?src-supplier=Element14
R15#1 R15#2 = CMP-2002-07472-1: ±1% 1/16W ±100ppm/℃ 1kΩ 0402 Chip Resistor - Surface Mount ROHS; Part Number: RC0402FR-071KL; Manufacturer: Yageo / Phycomp; Resistance: 1kR; Power Rating: 62.5mW; Voltage Rating: 50V; Temperature Coefficient: 100ppm/°C; Max Power Dissipation: 63mW; Supplier 1: Digi-Key; Supplier Part Number 1: 311-1.00KLRCT-ND; Manufacturer Part Number: RC0402FR-071KL; RoHS: Yes; Category: Chip SMD Resistors; Stock 1: 21620273; Pricing 1: 1=0.10000, 10=0.01600, 100=0.00660, 1000=0.00299, 2500=0.00259, 5000=0.00214 (USD); Case/Package: 0402; Number of Pins: 2; Case Code (Imperial): 0402; Case Code (Metric): 1005; Size Code: 0402; Min Operating Temperature: -55°C; Max Operating Temperature: 155°C; Packaging: Tape and Reel; Termination: SMD/SMT; Tolerance: 1%; Series: RC; Resistor Type: Thick Film; Number of Terminations: 2; Resistance Tolerance: 1%; Construction: Rectangular; Features: Moisture Resistant; Voltage Rating (DC): 50V; Technology: THICK FILM; Length: 1mm; Width: 0.5mm; Height: 0.32mm; Depth: 0.5mm; REACH SVHC: Unknown; Military Standard: Not; RoHS Compliant: Yes; Lead Free: Lead Free; ComponentLink1URL: https://datasheet.ciiva.com/11819/0900766b80c66297-11819477.pdf?src-supplier=RSComponents; ComponentLink1Description: https://datasheet.ciiva.com/11819/0900766b80c66297-11819477.pdf?src-supplier=RSComponents; ComponentLink2URL: https://datasheet.ciiva.com/12666/pyu-rc0402-51-rohs-l-6-r-12666741.pdf?src-supplier=Mouser; ComponentLink2Description: https://datasheet.ciiva.com/12666/pyu-rc0402-51-rohs-l-6-r-12666741.pdf?src-supplier=Mouser; ComponentLink3URL: https://datasheet.ciiva.com/17063/pyu-rc0402-51-rohs-l-6-r-17063193.pdf?src-supplier=Future+Electronics; ComponentLink3Description: https://datasheet.ciiva.com/17063/pyu-rc0402-51-rohs-l-6-r-17063193.pdf?src-supplier=Future+Electronics; ComponentLink4URL: https://datasheet.ciiva.com/22747/1018594-22747513.pdf?src-supplier=Element14; ComponentLink4Description: https://datasheet.ciiva.com/22747/1018594-22747513.pdf?src-supplier=Element14; ComponentLink5URL: https://datasheet.ciiva.com/7849/1018594-7849869.pdf?src-supplier=Element14; ComponentLink5Description: https://datasheet.ciiva.com/7849/1018594-7849869.pdf?src-supplier=Element14; ComponentLink6URL: https://datasheet.ciiva.com/7983/1018594-7983502.pdf?src-supplier=Element14; ComponentLink6Description: https://datasheet.ciiva.com/7983/1018594-7983502.pdf?src-supplier=Element14; ComponentLink7URL: https://datasheet.ciiva.com/7849/1018594-7849871.pdf?src-supplier=Element14; ComponentLink7Description: https://datasheet.ciiva.com/7849/1018594-7849871.pdf?src-supplier=Element14; JLCPCB Part #: C11702
Rcsn1 = FCSL32R010FER: Resistors FCSL Series Metal Foil Power Rating 1.5W Tape Reel Resistance 20 mOhms; Manufacturer_Name: Ohmite; Manufacturer_Part_Number: FCSL32R020FER; Datasheet Link: https://www.mouser.com/datasheet/2/303/res_fcsl-1265567.pdf; Height: 0.8mm; Mouser Part Number: 588-FCSL32R020FER; Mouser Price/Stock: https://www.mouser.co.uk/ProductDetail/Ohmite/FCSL32R010FER?qs=y6ZabgHbY%252Bzyqz46BACxrg%3D%3D; Supplier 1: Digi-Key; Supplier Part Number 1: FCSL32R020FERCT-ND; Manufacturer: Ohmite; Manufacturer Part Number: FCSL32R020FER; RoHS: Yes; Category: Chip SMD Resistors; Stock 1: 1940; Pricing 1: 1=0.63000, 10=0.45000, 25=0.35120, 50=0.29700, 100=0.23400, 250=0.19800, 500=0.16200, 1000=0.12600 (USD); ComponentLink1URL: http://www.farnell.com/datasheets/2645666.pdf?src-supplier=Farnell; ComponentLink1Description: http://www.farnell.com/datasheets/2645666.pdf?src-supplier=Farnell
TP1-TP4 = TESTPOINT: SMD test pin
U1 U5#1-U5#3 = TI-SN74XXX1X08-5: Single 2-Input Positive-AND Gate, DCK0005A, SMALL T&R; Generic Part Number: SN74AHC1G08; Manufacturer: Texas Instruments; Schmitt Trigger: No; ICC @ Nom Voltage(Max)(mA): 0.01; Technology Family: AHC; Output Drive (IOL/IOH)(Max)(mA): 50/-50; tpd @ Nom Voltage(Max)(ns): 12.3,7.9; Logic: True; Gate Type: AND; VCC(Min)(V): 2; Input Type: CMOS; Voltage(Nom)(V): 3.3,5; Bits(#): 1; VCC(Max)(V): 5.5; F @ Nom Voltage(Max)(Mhz): 75; Rating: Catalog; 3-State Output: No; Operating Temperature Range(C): -55 to 125; DatasheetVersion: SCLS314N; Sub-Family: AND Gate; Output Type: CMOS; PackageReference: DCK0005A
U2 = TI-SN74XXXXXX126-5: Single Bus Buffer Gate With 3-State Output, DCK0005A, LARGE T&R; Manufacturer: Texas Instruments; Bits(#): 1; 3-State Output: Yes; Input Type: CMOS; VCC(Min)(V): 2; Schmitt Trigger: No; Rating: Catalog; tpd @ Nom Voltage(Max)(ns): 6; Voltage(Nom)(V): 5; Technology Family: AHCT; ICC @ Nom Voltage(Max)(mA): 0.01; Output Drive (IOL/IOH)(Max)(mA): 8/-8; Sub-Family: Non-Inverting Buffer/Driver; VCC(Max)(V): 5.5; F @ Nom Voltage(Max)(Mhz): 75; Logic: True; Generic Part Number: SN74AHCT1G126; Operating Temperature Range(C): -40 to 125; Output Type: CMOS; PackageReference: DCK0005A; DatasheetVersion: SCLS380J
U3 = 1EDN8550B: Single-channel EiceDRIVER™ with true  differential inputs
U4 = NCP5901BMNTBG: Integrated Circuit; Manufacturer_Name: ON Semiconductor; Datasheet Link: http://www.onsemi.com/pub/Collateral/NCP5901B-D.PDF; Height: 1mm; Manufacturer_Part_Number: NCP5901BMNTBG; Mouser Part Number: 863-NCP5901BMNTBG; Mouser Price/Stock: https://www.mouser.co.uk/ProductDetail/ON-Semiconductor/NCP5901BMNTBG?qs=UikTwjRNStJje%252BaGWM%2F5BQ%3D%3D; Arrow Part Number: NCP5901BMNTBG; Arrow Price/Stock: https://www.arrow.com/en/products/ncp5901bmntbg/on-semiconductor; Parameter 1: *; JLCPCB Part #: *
U6 = TC7W53FK: 2-Channel Multiplexer/Demultiplexer
U? = IC_Comparator_LT1011: IC SMD Voltage Comparator SOIC-8; Manufacturer 1: Linear Technology; Manufacturer Part Number 1: LT1011CS8#PBF; Voltage - Supply: 2.7 V ~ 16 V, ±1.35 V ~ 8 V; SCDType: undef; Supplier 1: Digi-Key; Supplier Part Number 1: LT1011CS8#PBF-ND; Package / Case: 8-SOIC (0.154", 3.90mm Width)